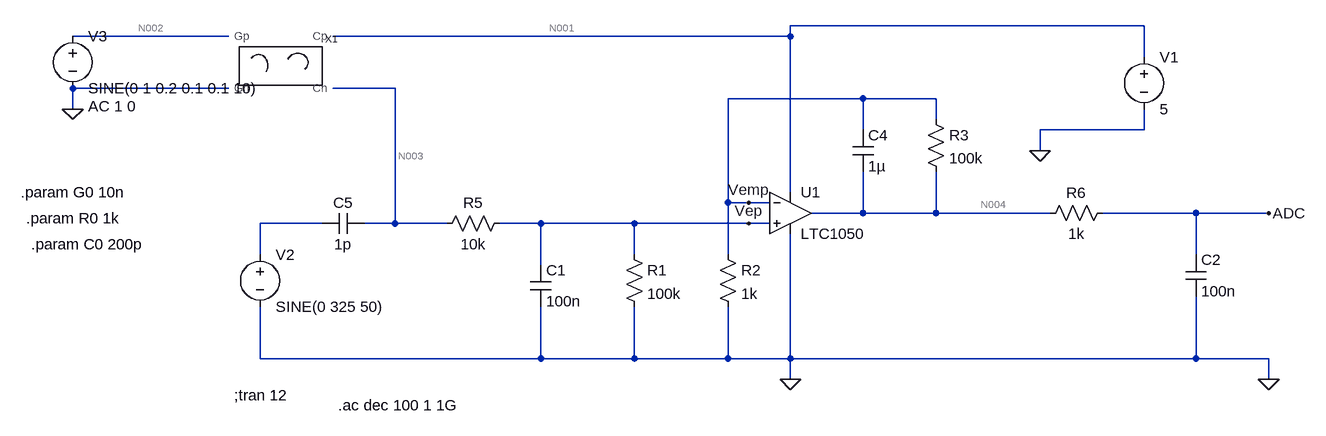
[diagram p0: schematic Circuit avec capteur.asc]
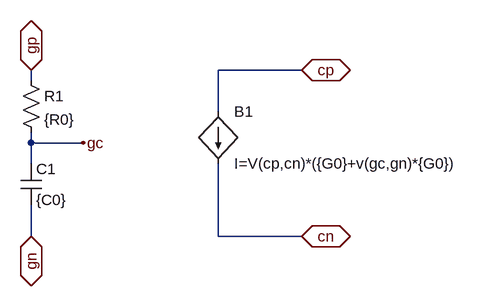
[diagram p1: sub-circuit gp_capteur_graphite.asc]
Circuit avec capteur.asc, the LTspice schematic file:
Version 4
SHEET 1 880 680
WIRE 352 16 -192 16
WIRE -1056 32 -1296 32
WIRE -192 32 -192 16
WIRE -192 32 -896 32
WIRE 352 64 352 16
WIRE -1056 112 -1296 112
WIRE -800 112 -896 112
WIRE -80 128 -288 128
WIRE 32 128 -80 128
WIRE -1296 144 -1296 112
WIRE 32 160 32 128
WIRE -80 176 -80 128
WIRE 352 176 352 144
WIRE 352 176 192 176
WIRE 192 208 192 176
WIRE -192 272 -192 32
WIRE -288 288 -288 128
WIRE -256 288 -288 288
WIRE -224 288 -256 288
WIRE -80 304 -80 240
WIRE -80 304 -160 304
WIRE 32 304 32 240
WIRE 32 304 -80 304
WIRE 208 304 32 304
WIRE 432 304 288 304
WIRE 544 304 432 304
WIRE -912 320 -1008 320
WIRE -800 320 -800 112
WIRE -800 320 -848 320
WIRE -720 320 -800 320
WIRE -576 320 -640 320
WIRE -432 320 -576 320
WIRE -256 320 -432 320
WIRE -224 320 -256 320
WIRE -1008 368 -1008 320
WIRE -432 368 -432 320
WIRE -288 368 -288 288
WIRE 432 368 432 304
WIRE -576 384 -576 320
WIRE -1008 528 -1008 448
WIRE -576 528 -576 448
WIRE -576 528 -1008 528
WIRE -432 528 -432 448
WIRE -432 528 -576 528
WIRE -288 528 -288 448
WIRE -288 528 -432 528
WIRE -192 528 -192 336
WIRE -192 528 -288 528
WIRE 432 528 432 432
WIRE 432 528 -192 528
WIRE 544 528 432 528
WIRE -192 560 -192 528
WIRE 544 560 544 528
FLAG -192 560 0
FLAG 544 560 0
FLAG 192 208 0
FLAG 544 304 ADC
FLAG -256 288 Vemp
FLAG -256 320 Vep
FLAG -1296 144 0
SYMBOL voltage 352 48 R0
WINDOW 123 0 0 Left 0
WINDOW 39 0 0 Left 0
SYMATTR InstName V1
SYMATTR Value 5
SYMBOL OpAmps\\LTC1050 -192 240 R0
SYMATTR InstName U1
SYMBOL res 16 144 R0
SYMATTR InstName R3
SYMATTR Value 100k
SYMBOL cap -96 176 R0
SYMATTR InstName C4
SYMATTR Value 1µ
SYMBOL res 304 288 R90
WINDOW 0 0 56 VBottom 2
WINDOW 3 32 56 VTop 2
SYMATTR InstName R6
SYMATTR Value 1k
SYMBOL res -304 352 R0
SYMATTR InstName R2
SYMATTR Value 1k
SYMBOL res -448 352 R0
SYMATTR InstName R1
SYMATTR Value 100k
SYMBOL cap -592 384 R0
SYMATTR InstName C1
SYMATTR Value 100n
SYMBOL res -624 304 R90
WINDOW 0 0 56 VBottom 2
WINDOW 3 32 56 VTop 2
SYMATTR InstName R5
SYMATTR Value 10k
SYMBOL cap 416 368 R0
SYMATTR InstName C2
SYMATTR Value 100n
SYMBOL voltage -1008 352 R0
WINDOW 123 0 0 Left 0
WINDOW 39 0 0 Left 0
SYMATTR InstName V2
SYMATTR Value SINE(0 325 50)
SYMBOL cap -848 304 R90
WINDOW 0 0 32 VBottom 2
WINDOW 3 32 32 VTop 2
SYMATTR InstName C5
SYMATTR Value 1p
SYMBOL GP_Capteur_Graphite -992 48 R0
SYMATTR InstName X1
SYMBOL voltage -1296 16 R0
WINDOW 123 24 124 Left 2
WINDOW 39 0 0 Left 0
SYMATTR Value2 AC 1 0
SYMATTR InstName V3
SYMATTR Value SINE(0 1 0.2 0.1 0.1 10)
TEXT -1048 584 Left 2 !;tran 12
TEXT -888 600 Left 2 !.ac dec 100 1 1G
TEXT -1376 272 Left 2 !.param G0 10n
TEXT -1368 312 Left 2 !.param R0 1k
TEXT -1360 352 Left 2 !.param C0 200p

gp_capteur_graphite.asc, the sub-circuit schematic file:
Version 4
SHEET 1 880 680
WIRE 480 16 352 16
WIRE 64 32 64 16
WIRE 352 80 352 16
WIRE 64 128 64 112
WIRE 144 128 64 128
WIRE 64 160 64 128
WIRE 64 272 64 224
WIRE 352 272 352 160
WIRE 480 272 352 272
FLAG 64 16 gp
IOPIN 64 16 BiDir
FLAG 64 272 gn
IOPIN 64 272 BiDir
FLAG 144 128 gc
FLAG 480 16 cp
IOPIN 480 16 BiDir
FLAG 480 272 cn
IOPIN 480 272 BiDir
SYMBOL res 48 16 R0
SYMATTR InstName R1
SYMATTR Value {R0}
SYMBOL cap 48 160 R0
SYMATTR InstName C1
SYMATTR Value {C0}
SYMBOL bi 352 80 R0
SYMATTR InstName B1
SYMATTR Value I=V(cp,cn)*({G0}+v(gc,gn)*{G0})

The netlist it stands for:
* Circuit avec capteur.asc
V1 N001 0 5
XU1 Vep Vemp N001 0 N004 LTC1050  ; pins In+ In- V+ V- OUT
R3 Vemp N004 100k
C4 Vemp N004 1µ
R6 ADC N004 1k
R2 Vemp 0 1k
R1 Vep 0 100k
C1 Vep 0 100n
R5 Vep N003 10k
C2 ADC 0 100n
V2 N005 0 SINE(0 325 50)
C5 N003 N005 1p
XX1 N001 N003 N002 0 gp_capteur_graphite
V3 N002 0 SINE(0 1 0.2 0.1 0.1 10) AC 1 0

* block symbol definitions
.subckt gp_capteur_graphite Cp Cn Gp Gn
R1 gp gc {R0}
C1 gc gn {C0}
B1 cp cn I=V(cp,cn)*({G0}+v(gc,gn)*{G0})
.ends gp_capteur_graphite

;tran 12
.ac dec 100 1 1G
.param G0 10n
.param R0 1k
.param C0 200p
.lib LTC.lib
.backanno
.end

* Results of the author's LTspice run, read from the files saved beside the schematic
* Operating Point, zero values left out:
*   V(n001) = 5 V
*   V(vemp) = 5.861 mV
*   V(vep) = 5.861 mV
*   V(n004) = 591.9 mV
*   V(adc) = 591.9 mV
*   V(n003) = 6.447 mV
*   V(n002) = 173.6 mV
*   I(R3) = -5.861 µA
*   I(R2) = 5.861 µA
*   I(R1) = 58.61 nA
*   I(R5) = -58.61 nA
*   I(V1) = -754.6 µA
*   Ix(u1:3) = 754.5 µA
*   Ix(u1:4) = -748.7 µA
*   Ix(u1:5) = -5.861 µA
*   Ix(x1:CP) = 58.61 nA
*   Ix(x1:CN) = -58.61 nA
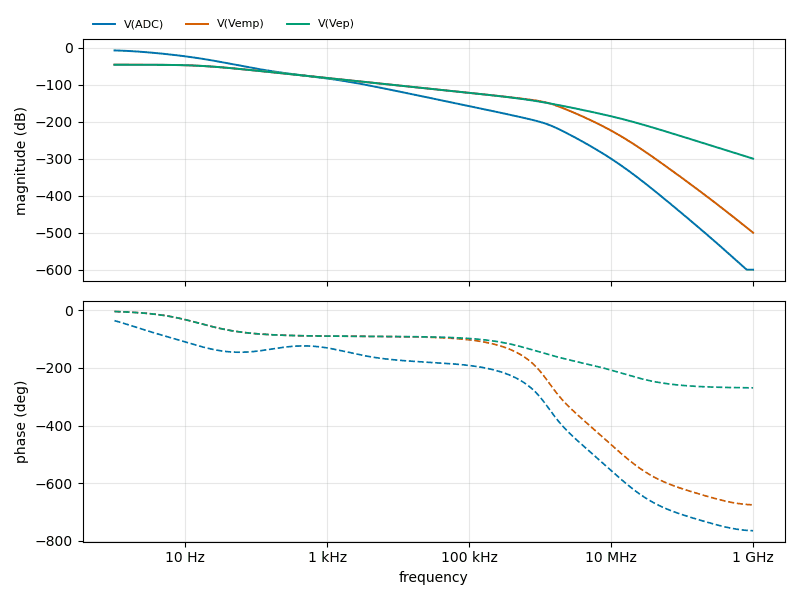
[diagram p2: AC Analysis of Circuit avec capteur.asc, plotted from the saved traces]
* AC Analysis, 1 run:
*   V(ADC): -7.42 dB at 1 Hz, -600.00 dB at 1 GHz, peak -7.42 dB at 1 Hz, 3 dB below the peak at 2.107 Hz
*   V(Vemp): -46.06 dB at 1 Hz, -499.92 dB at 1 GHz, peak -46.06 dB at 1 Hz, 3 dB below the peak at 15.99 Hz
*   V(Vep): -46.06 dB at 1 Hz, -299.94 dB at 1 GHz, peak -46.06 dB at 1 Hz, 3 dB below the peak at 16 Hz